# Altium project carrier.PrjPcb (part 2 of 2)

## Sheet ethernet_hdmi.SchDoc: Ethernet & HDMI
size A4; Organization: GPA Robotics; DocumentNumber: 9; Revision: REV 0; SheetNumber: 9; SheetTotal: 11
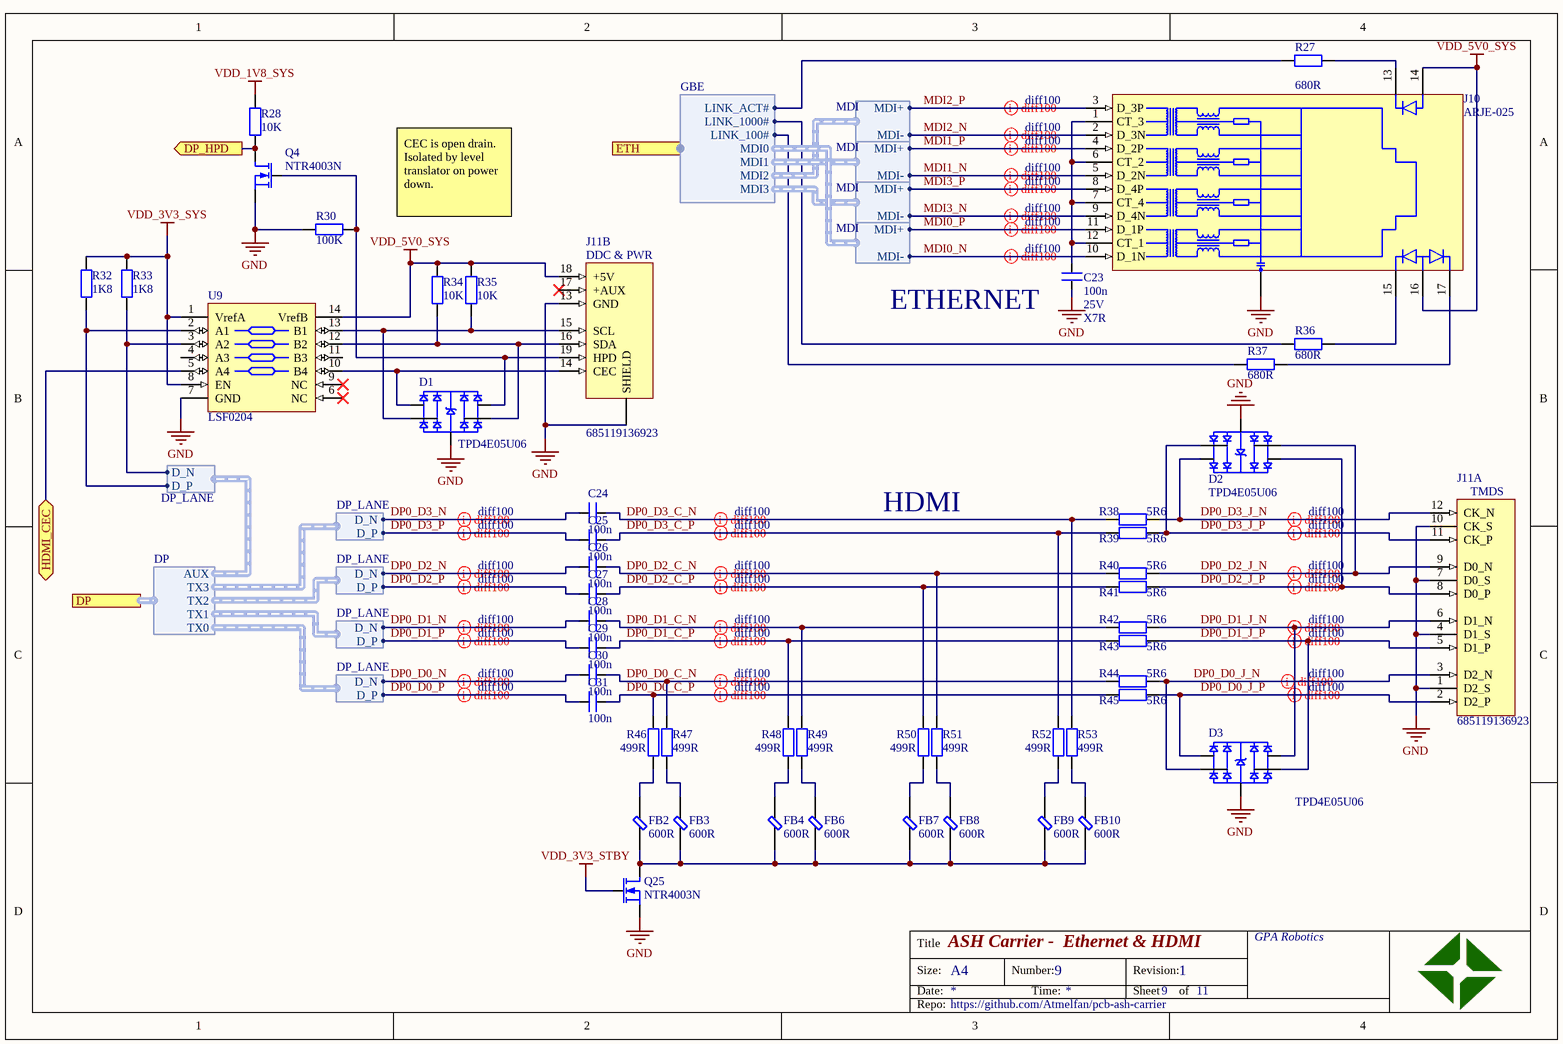
[diagram p7: ethernet_hdmi.SchDoc]

### Parts
C23  value 100n  Voltage: 25V  Type: X7R  [C1005[0402]]  (hidden comment: cap)
C24  value 100n  [C1005[0402]]  (hidden comment: cap)
C25  value 100n  [C1005[0402]]  (hidden comment: cap)
C26  value 100n  [C1005[0402]]  (hidden comment: cap)
C27  value 100n  [C1005[0402]]  (hidden comment: cap)
C28  value 100n  [C1005[0402]]  (hidden comment: cap)
C29  value 100n  [C1005[0402]]  (hidden comment: cap)
C30  value 100n  [C1005[0402]]  (hidden comment: cap)
C31  value 100n  [C1005[0402]]  (hidden comment: cap)
D1  TPD4E05U06  [TI_PSON50P100X55-10N]
D2  TPD4E05U06  [TI_PSON50P100X55-10N]
D3  TPD4E05U06  [TI_PSON50P100X55-10N]
FB2  value 600R  [FBC1005X06N]  (hidden comment: Ferrite bead)
FB3  value 600R  [FBC1005X06N]  (hidden comment: Ferrite bead)
FB4  value 600R  [FBC1005X06N]  (hidden comment: Ferrite bead)
FB6  value 600R  [FBC1005X06N]  (hidden comment: Ferrite bead)
FB7  value 600R  [FBC1005X06N]  (hidden comment: Ferrite bead)
FB8  value 600R  [FBC1005X06N]  (hidden comment: Ferrite bead)
FB9  value 600R  [FBC1005X06N]  (hidden comment: Ferrite bead)
FB10  value 600R  [FBC1005X06N]  (hidden comment: Ferrite bead)
J10  ARJE-025  [abraconn_rj45_arje0025]
J11  685119136923  [wurth_hdmi_mini]  (parts A,B of 2)
Q4  NTR4003N  [NCH_SOT95P237X110-3N]
Q25  NTR4003N  [NCH_SOT95P237X110-3N]
R27  value 680R  [R1005[0402]]  (hidden comment: res)
R28  value 10K  [R1005[0402]]  (hidden comment: res)
R30  value 100K  [R1005[0402]]  (hidden comment: res)
R32  value 1K8  [R1005[0402]]  (hidden comment: res)
R33  value 1K8  [R1005[0402]]  (hidden comment: res)
R34  value 10K  [R1005[0402]]  (hidden comment: res)
R35  value 10K  [R1005[0402]]  (hidden comment: res)
R36  value 680R  [R1005[0402]]  (hidden comment: res)
R37  value 680R  [R1005[0402]]  (hidden comment: res)
R38  value 5R6  [R1005[0402]]  (hidden comment: res)
R39  value 5R6  [R1005[0402]]  (hidden comment: res)
R40  value 5R6  [R1005[0402]]  (hidden comment: res)
R41  value 5R6  [R1005[0402]]  (hidden comment: res)
R42  value 5R6  [R1005[0402]]  (hidden comment: res)
R43  value 5R6  [R1005[0402]]  (hidden comment: res)
R44  value 5R6  [R1005[0402]]  (hidden comment: res)
R45  value 5R6  [R1005[0402]]  (hidden comment: res)
R46  value 499R  [R1005[0402]]  (hidden comment: res)
R47  value 499R  [R1005[0402]]  (hidden comment: res)
R48  value 499R  [R1005[0402]]  (hidden comment: res)
R49  value 499R  [R1005[0402]]  (hidden comment: res)
R50  value 499R  [R1005[0402]]  (hidden comment: res)
R51  value 499R  [R1005[0402]]  (hidden comment: res)
R52  value 499R  [R1005[0402]]  (hidden comment: res)
R53  value 499R  [R1005[0402]]  (hidden comment: res)
U9  LSF0204  [TI_TSOP65P640X120-14N]

### Ports
DP (harness DP), DP_HPD (out), ETH (harness GBE), HDMI_CEC (bidir)

### Harnesses
GBE: LINK_ACT#, LINK_1000#, LINK_100#, MDI0, MDI1, MDI2, MDI3
MDI: MDI+, MDI-
DP_LANE: D_N, D_P
DP: TX0, TX1, TX2, TX3, AUX

### Nets
GND: C23.1 D1.3(GND) D2.3(GND) D3.3(GND) J10.SHIELD J11.1(D2_S) J11.4(D1_S) J11.7(D0_S) J11.10(CK_S) J11.13(GND) J11.SHIELD Q4.S Q25.S R30.2 U9.7(GND)
VDD_1V8_SYS: R28.2
VDD_3V3_STBY: Q25.G
VDD_3V3_SYS: R32.2 R33.2 U9.1(VrefA) U9.8(EN)
VDD_5V0_SYS: J10.14 J10.16 J11.18(+5V) R34.2 R35.2 U9.14(VrefB)
DP0_D0_C_N: C30.1 R44.1 R47.2
DP0_D0_C_P: C31.1 R45.1 R46.2
DP0_D0_J_N: D3.4(D2-) J11.3(D2_N) R44.2
DP0_D0_J_P: D3.5(D2+) J11.2(D2_P) R45.2
DP0_D0_N: C30.2 ; harness DP_LANE.D_N
DP0_D0_P: C31.2 ; harness DP_LANE.D_P
DP0_D1_C_N: C28.1 R42.1 R49.2
DP0_D1_C_P: C29.1 R43.1 R48.2
DP0_D1_J_N: D3.1(D1+) J11.6(D1_N) R42.2
DP0_D1_J_P: D3.2(D1-) J11.5(D1_P) R43.2
DP0_D1_N: C28.2 ; harness DP_LANE.D_N
DP0_D1_P: C29.2 ; harness DP_LANE.D_P
DP0_D2_C_N: C26.1 R40.1 R51.2
DP0_D2_C_P: C27.1 R41.1 R50.2
DP0_D2_J_N: D2.2(D1-) J11.9(D0_N) R40.2
DP0_D2_J_P: D2.1(D1+) J11.8(D0_P) R41.2
DP0_D2_N: C26.2 ; harness DP_LANE.D_N
DP0_D2_P: C27.2 ; harness DP_LANE.D_P
DP0_D3_C_N: C24.1 R38.1 R53.2
DP0_D3_C_P: C25.1 R39.1 R52.2
DP0_D3_J_N: D2.5(D2+) J11.12(CK_N) R38.2
DP0_D3_J_P: D2.4(D2-) J11.11(CK_P) R39.2
DP0_D3_N: C24.2 ; harness DP_LANE.D_N
DP0_D3_P: C25.2 ; harness DP_LANE.D_P
MDI0_N: J10.10(D_1N) ; harness MDI.MDI-
MDI0_P: J10.11(D_1P) ; harness MDI.MDI+
MDI1_N: J10.5(D_2N) ; harness MDI.MDI-
MDI1_P: J10.4(D_2P) ; harness MDI.MDI+
MDI2_N: J10.2(D_3N) ; harness MDI.MDI-
MDI2_P: J10.3(D_3P) ; harness MDI.MDI+
MDI3_N: J10.9(D_4N) ; harness MDI.MDI-
MDI3_P: J10.8(D_4P) ; harness MDI.MDI+
NetC23_2: C23.2 J10.1(CT_3) J10.6(CT_2) J10.7(CT_4) J10.12(CT_1)
NetD1_1: D1.1(D1+) J11.14(CEC) U9.10(B4)
NetD1_2: D1.2(D1-) J11.15(SCL) R35.1 U9.13(B1)
NetD1_4: D1.4(D2-) J11.16(SDA) R34.1 U9.12(B2)
NetD1_5: D1.5(D2+) J11.19(HPD) Q4.G R30.1
NetFB2_1: FB2.1 FB3.1 FB4.1 FB6.1 FB7.1 FB8.1 FB9.1 FB10.1 Q25.D
NetFB2_2: FB2.2 R46.1
NetFB3_2: FB3.2 R47.1
NetFB4_2: FB4.2 R48.1
NetFB6_2: FB6.2 R49.1
NetFB7_2: FB7.2 R50.1
NetFB8_2: FB8.2 R51.1
NetFB9_2: FB9.2 R52.1
NetFB10_2: FB10.2 R53.1
NetJ1_B33: U9.5(A4) ; port HDMI_CEC
NetJ1_B34: R33.1 U9.3(A2) ; harness DP_LANE.D_N
NetJ1_B35: R32.1 U9.2(A1) ; harness DP_LANE.D_P
NetJ1_B36: Q4.D R28.1 ; port DP_HPD
NetJ1_E47: R27.2 ; port ETH.LINK_ACT#
NetJ1_F46: R36.1 ; port ETH.LINK_1000#
NetJ1_F50: R37.2 ; port ETH.LINK_100#
NetJ10_13: J10.13 R27.1
NetJ10_15: J10.15 R36.2
NetJ10_17: J10.17 R37.1

Not connected (* = marked no-connect by the designer): J11 17(+AUX)*; U9 4(A3) 6(NC)* 9(NC)* 11(B3)

### Layout directives
differential pair; net class diff100: DP0_D0_C_N, DP0_D0_C_P, DP0_D0_J_N, DP0_D0_J_P, DP0_D0_N, DP0_D0_P, DP0_D1_C_N, DP0_D1_C_P, DP0_D1_J_N, DP0_D1_J_P, DP0_D1_N, DP0_D1_P, DP0_D2_C_N, DP0_D2_C_P, DP0_D2_J_N, DP0_D2_J_P, DP0_D2_N, DP0_D2_P, DP0_D3_C_N, DP0_D3_C_P, DP0_D3_J_N, DP0_D3_J_P, DP0_D3_N, DP0_D3_P, MDI0_N, MDI0_P, MDI1_N, MDI1_P, MDI2_N, MDI2_P, MDI3_N, MDI3_P

### Notes on the sheet
- CEC is open drain.
  Isolated by level translator on power down.
- ETHERNET
- HDMI
- Title
- Size:
- Date:
- A4
- Number:
- Time:
- Revision:
- Sheet
- of
- Repo:
- (in symbol hdmi_mini_c, part A) TMDS
- (in symbol hdmi_mini_c, part B) DDC & PWR

### Library data of the parts
C23 = cap: Capacitor; Manufacturer: *; Series: *
C24-C31 = cap: Capacitor; Voltage: 25V; Type: X7R; Manufacturer: *; Series: *
FB2-FB4 FB6-FB10 = ferrite_bead: Frequency: 100M
J10 = geth_wmagnetics: RJ45 with integrated magnetics
J11 = hdmi_mini_c
Q4 Q25 = nch_mosfet
R27 R28 R30 R32-R53 = res: Resistor

## Sheet m2_connector.SchDoc: SD card & expansion
size A4; Organization: GPA Robotics; DocumentNumber: 4; Revision: REV 0; SheetNumber: 4; SheetTotal: 11
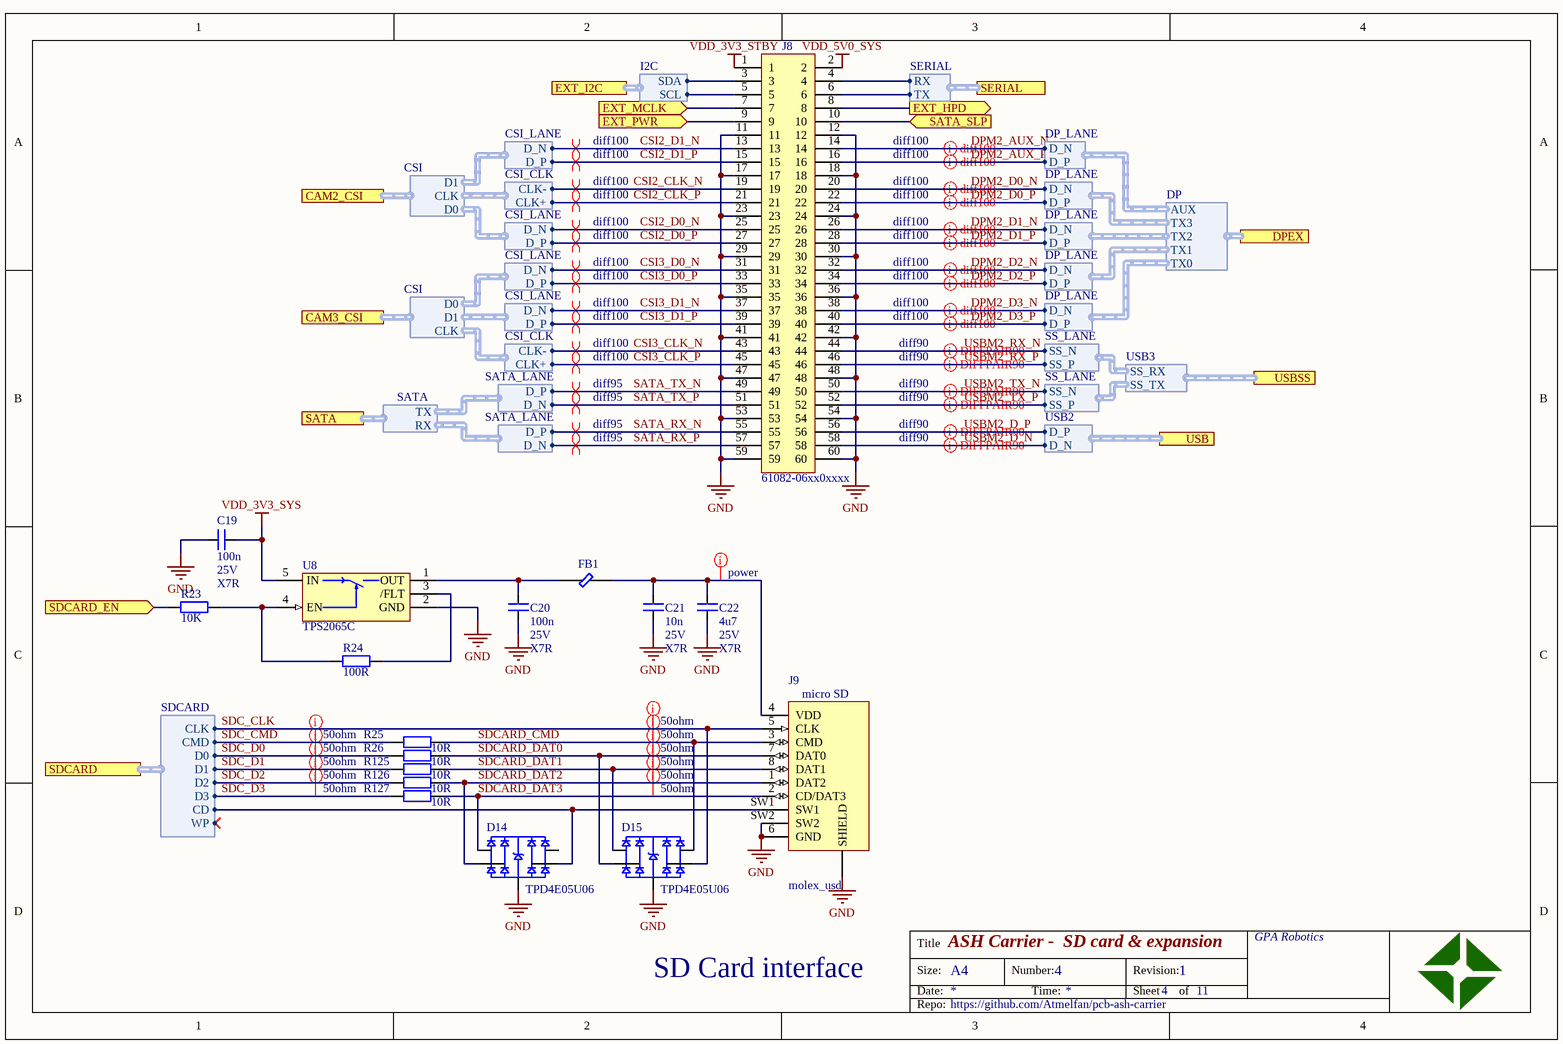
[diagram p8: m2_connector.SchDoc]

### Parts
C19  value 100n  Voltage: 25V  Type: X7R  [C1005[0402]]  (hidden comment: cap)
C20  value 100n  Voltage: 25V  Type: X7R  [C1005[0402]]  (hidden comment: cap)
C21  value 10n  Voltage: 25V  Type: X7R  [C1005[0402]]  (hidden comment: cap)
C22  value 4u7  Voltage: 25V  Type: X7R  [C3216[1206]]  (hidden comment: cap)
D14  TPD4E05U06  [TI_PSON50P100X55-10N]
D15  TPD4E05U06  [TI_PSON50P100X55-10N]
FB1  2506036007Y3  [FBC1608X07N]  (value not drawn)
J8  61082-06xx0xxxx  [fci_mezzanine_61082]
J9  molex_usd  [molex_usd]
R23  value 10K  [R1005[0402]]  (hidden comment: res)
R24  value 100R  [R1005[0402]]  (hidden comment: res)
R25  value 10R  [R1005[0402]]  (hidden comment: res)
R26  value 10R  [R1005[0402]]  (hidden comment: res)
R125  value 10R  [R1005[0402]]  (hidden comment: res)
R126  value 10R  [R1005[0402]]  (hidden comment: res)
R127  value 10R  [R1005[0402]]  (hidden comment: res)
U8  TPS2065C  [TI_SOT95P280X145-5N]

### Ports
CAM2_CSI (harness CSI), CAM3_CSI (harness CSI), DPEX (harness DP), EXT_HPD (out), EXT_I2C (harness I2C), EXT_MCLK (in), EXT_PWR (in), SATA (harness SATA), SATA_SLP (in), SDCARD (harness SDCARD), SDCARD_EN (in), SERIAL (harness SERIAL), USB (harness USB2), USBSS (harness USB3)

### Harnesses
SDCARD: CLK, CMD, WP, CD, D0, D1, D2, D3
SS_LANE: SS_P, SS_N
USB3: SS_RX, SS_TX
DP_LANE: D_N, D_P
DP: TX0, TX1, TX2, TX3, AUX
CSI_LANE: D_P, D_N
CSI_CLK: CLK-, CLK+
CSI: CLK, D0, D1
I2C: SDA, SCL
SATA_LANE: D_P, D_N
SATA: TX, RX
SERIAL: RX, TX
USB2: D_P, D_N

### Nets
GND: C19.2 C20.1 C21.1 C22.1 D14.3(GND) D15.3(GND) J8.11 J8.12 J8.17 J8.18 J8.23 J8.24 J8.29 J8.30 J8.35 J8.36 J8.41 J8.42 J8.47 J8.48 J8.53 J8.54 J8.59 J8.60 J9.6(GND) J9.SHIELD J9.SW2 U8.2(GND)
VDD_3V3_STBY: J8.1
VDD_3V3_SYS: C19.1 U8.5(IN)
VDD_5V0_SYS: J8.2
CSI2_CLK_N: J8.19 ; harness CSI_CLK.CLK-
CSI2_CLK_P: J8.21 ; harness CSI_CLK.CLK+
CSI2_D0_N: J8.25 ; harness CSI_LANE.D_N
CSI2_D0_P: J8.27 ; harness CSI_LANE.D_P
CSI2_D1_N: J8.13 ; harness CSI_LANE.D_N
CSI2_D1_P: J8.15 ; harness CSI_LANE.D_P
CSI3_CLK_N: J8.43 ; harness CSI_CLK.CLK-
CSI3_CLK_P: J8.45 ; harness CSI_CLK.CLK+
CSI3_D0_N: J8.31 ; harness CSI_LANE.D_N
CSI3_D0_P: J8.33 ; harness CSI_LANE.D_P
CSI3_D1_N: J8.37 ; harness CSI_LANE.D_N
CSI3_D1_P: J8.39 ; harness CSI_LANE.D_P
DPM2_AUX_N: J8.14 ; harness DP_LANE.D_N
DPM2_AUX_P: J8.16 ; harness DP_LANE.D_P
DPM2_D0_N: J8.20 ; harness DP_LANE.D_N
DPM2_D0_P: J8.22 ; harness DP_LANE.D_P
DPM2_D1_N: J8.26 ; harness DP_LANE.D_N
DPM2_D1_P: J8.28 ; harness DP_LANE.D_P
DPM2_D2_N: J8.32 ; harness DP_LANE.D_N
DPM2_D2_P: J8.34 ; harness DP_LANE.D_P
DPM2_D3_N: J8.38 ; harness DP_LANE.D_N
DPM2_D3_P: J8.40 ; harness DP_LANE.D_P
SATA_RX_N: J8.55 ; harness SATA_LANE.D_P
SATA_RX_P: J8.57 ; harness SATA_LANE.D_N
SATA_TX_N: J8.49 ; harness SATA_LANE.D_P
SATA_TX_P: J8.51 ; harness SATA_LANE.D_N
SDC_CLK: D15.4(D2-) J9.5(CLK) ; port SDCARD.CLK
SDC_CMD: R25.1 ; port SDCARD.CMD
SDC_D0: R26.1 ; port SDCARD.D0
SDC_D1: R125.1 ; port SDCARD.D1
SDC_D2: R126.1 ; port SDCARD.D2
SDC_D3: R127.1 ; port SDCARD.D3
SDCARD_CMD: D15.5(D2+) J9.3(CMD) R25.2
SDCARD_DAT0: D15.2(D1-) J9.7(DAT0) R26.2
SDCARD_DAT1: D15.1(D1+) J9.8(DAT1) R125.2
SDCARD_DAT2: D14.2(D1-) J9.1(DAT2) R126.2
SDCARD_DAT3: D14.1(D1+) J9.2(CD/DAT3) R127.2
USBM2_D_N: J8.58 ; port USB.D_N
USBM2_D_P: J8.56 ; port USB.D_P
USBM2_RX_N: J8.44 ; harness SS_LANE.SS_N
USBM2_RX_P: J8.46 ; harness SS_LANE.SS_P
USBM2_TX_N: J8.50 ; harness SS_LANE.SS_N
USBM2_TX_P: J8.52 ; harness SS_LANE.SS_P
NetC20_2: C20.2 FB1.1 U8.1(OUT)
NetC21_2: C21.2 C22.2 FB1.2 J9.4(VDD)
NetD14_4: D14.4(D2-) J9.SW1 ; port SDCARD.CD
NetJ1_A20: J8.3 ; port EXT_I2C.SDA
NetJ1_A21: J8.5 ; port EXT_I2C.SCL
NetJ1_A33: J8.8 ; port EXT_HPD
NetJ1_B15: J8.4 ; port SERIAL.RX
NetJ1_B16: J8.6 ; port SERIAL.TX
NetJ1_D47: J8.10 ; port SATA_SLP
NetJ1_F7: J8.9 ; port EXT_PWR
NetJ1_F8: J8.7 ; port EXT_MCLK
NetJ1_H16: R23.1 ; port SDCARD_EN
NetR23_2: R23.2 R24.1 U8.4(EN)
NetR24_2: R24.2 U8.3(/FLT)

Not connected (* = marked no-connect by the designer): D14 5(D2+)

### Layout directives
net class power: NetC21_2
differential pair; net class diff90: USBM2_D_N, USBM2_D_P, USBM2_RX_N, USBM2_RX_P, USBM2_TX_N, USBM2_TX_P
differential pair; net class diff100: CSI2_CLK_N, CSI2_CLK_P, CSI2_D0_N, CSI2_D0_P, CSI2_D1_N, CSI2_D1_P, CSI3_CLK_N, CSI3_CLK_P, CSI3_D0_N, CSI3_D0_P, CSI3_D1_N, CSI3_D1_P, DPM2_AUX_N, DPM2_AUX_P, DPM2_D0_N, DPM2_D0_P, DPM2_D1_N, DPM2_D1_P, DPM2_D2_N, DPM2_D2_P, DPM2_D3_N, DPM2_D3_P
differential pair; net class diff95: SATA_RX_N, SATA_RX_P, SATA_TX_N, SATA_TX_P
net class 50ohm: SDC_CLK, SDC_CMD, SDC_D0, SDC_D1, SDC_D2, SDC_D3, SDCARD_CMD, SDCARD_DAT0, SDCARD_DAT1, SDCARD_DAT2, SDCARD_DAT3

### Notes on the sheet
- SD Card interface
- Title
- Size:
- Date:
- A4
- Number:
- Time:
- Revision:
- Sheet
- of
- Repo:
- (in symbol molex_usd) micro SD

### Library data of the parts
C19-C22 = cap: Capacitor; Manufacturer: *; Series: *
FB1 = ferrite_bead: Ferrite bead
J8 = mezzanine_2x30
R23-R26 R125-R127 = res: Resistor

## Sheet sound.SchDoc: Sound
size A4; DocumentNumber: 10; SheetNumber: 10; SheetTotal: 11
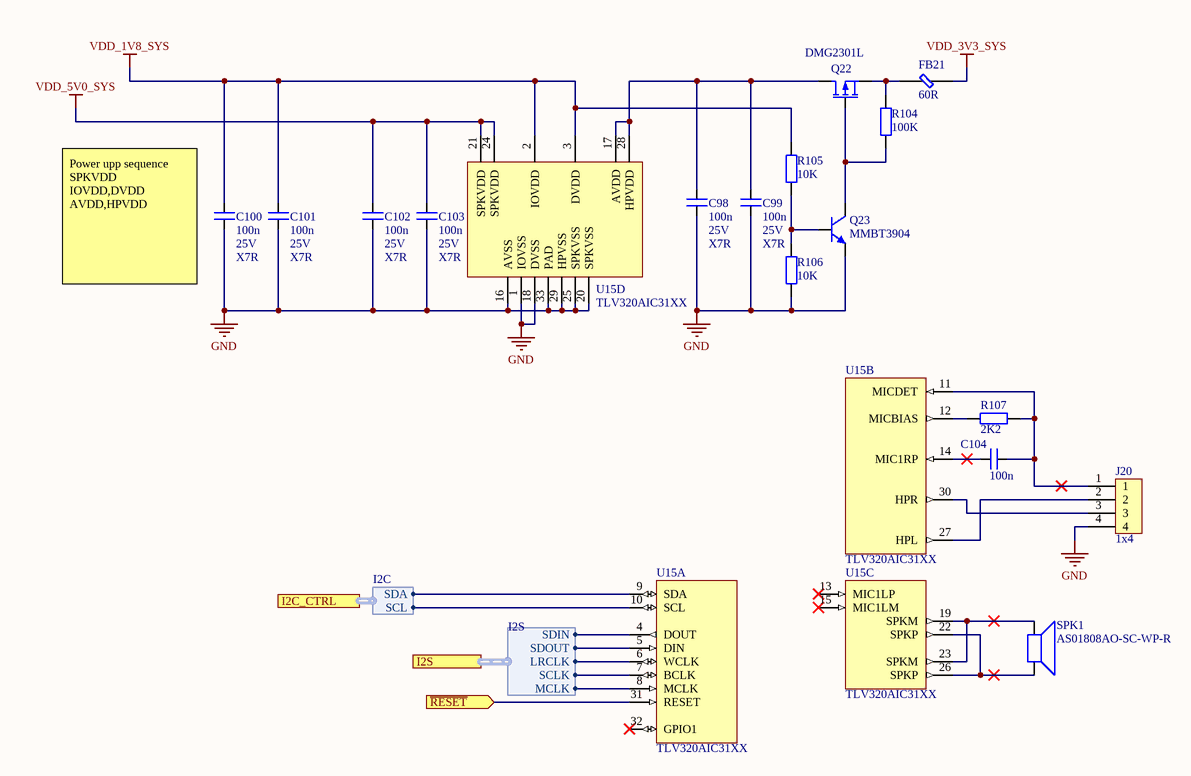
[diagram p9: sound.SchDoc]

### Parts
C98  value 100n  Voltage: 25V  Type: X7R  [C1005[0402]]  (hidden comment: cap)
C99  value 100n  Voltage: 25V  Type: X7R  [C1005[0402]]  (hidden comment: cap)
C100  value 100n  Voltage: 25V  Type: X7R  [C1005[0402]]  (hidden comment: cap)
C101  value 100n  Voltage: 25V  Type: X7R  [C1005[0402]]  (hidden comment: cap)
C102  value 100n  Voltage: 25V  Type: X7R  [C1005[0402]]  (hidden comment: cap)
C103  value 100n  Voltage: 25V  Type: X7R  [C1005[0402]]  (hidden comment: cap)
C104  value 100n  [C1005[0402]]  (hidden comment: cap)
FB21  value 60R  [FBC1608X07N]  (hidden comment: Ferrite bead)
J20  1x4  [molex_picoblade_1x4]
Q22  DMG2301L  [NCH_SOT95P237X110-3N]
Q23  MMBT3904  [NPN_SOT95P230X110-3N]
R104  value 100K  [R1005[0402]]  (hidden comment: res)
R105  value 10K  [R1005[0402]]  (hidden comment: res)
R106  value 10K  [R1005[0402]]  (hidden comment: res)
R107  value 2K2  [R1005[0402]]  (hidden comment: res)
SPK1  AS01808AO-SC-WP-R  [pui_audio_speaker]
U15  TLV320AIC31XX  [TI_QFN50P500X500X100_HS-33M]  (parts A,B,C,D of 4)

### Ports
I2C_CTRL (harness I2C), I2S (harness I2S), ~{RESET} (in)

### Harnesses
I2S: MCLK, LRCLK, SCLK, SDOUT, SDIN
I2C: SCL, SDA

### Nets
GND: C98.1 C99.1 C100.1 C101.1 C102.1 C103.1 J20.4 Q23.E R106.1 U15.1(IOVSS) U15.16(AVSS) U15.18(DVSS) U15.20(SPKVSS) U15.25(SPKVSS) U15.29(HPVSS) U15.33(PAD)
VDD_1V8_SYS: C100.2 C101.2 R105.1 U15.2(IOVDD) U15.3(DVDD)
VDD_3V3_SYS: FB21.1
VDD_5V0_SYS: C102.2 C103.2 U15.21(SPKVDD) U15.24(SPKVDD)
NetC98_2: C98.2 C99.2 Q22.D U15.17(AVDD) U15.28(HPVDD)
NetC104_1: C104.1 U15.14(MIC1RP)
NetC104_2: C104.2 J20.1 R107.1 U15.11(MICDET)
NetFB21_2: FB21.2 Q22.S R104.2
NetJ1_D15: U15.9(SDA) ; port I2C_CTRL.SDA
NetJ1_E15: U15.10(SCL) ; port I2C_CTRL.SCL
NetJ1_F1: U15.8(MCLK) ; port I2S.MCLK
NetJ1_F2: U15.31(RESET) ; port ~{RESET}
NetJ1_G1: U15.4(DOUT) ; port I2S.SDIN
NetJ1_G2: U15.7(BCLK) ; port I2S.SCLK
NetJ1_H1: U15.6(WCLK) ; port I2S.LRCLK
NetJ1_H2: U15.5(DIN) ; port I2S.SDOUT
NetJ20_2: J20.2 U15.27(HPL)
NetJ20_3: J20.3 U15.30(HPR)
NetQ22_G: Q22.G Q23.C R104.1
NetQ23_B: Q23.B R105.2 R106.2
NetR107_2: R107.2 U15.12(MICBIAS)
NetSPK1_1: SPK1.1 U15.19(SPKM) U15.23(SPKM)
NetSPK1_2: SPK1.2 U15.22(SPKP) U15.26(SPKP)

Not connected (* = marked no-connect by the designer): U15 13(MIC1LP)* 15(MIC1LM)* 32(GPIO1)*

### Notes on the sheet
- (near C100) Power upp sequence
  SPKVDD
  IOVDD,DVDD
  AVDD,HPVDD
- Title
- Size:
- Date:
- A4
- Number:
- Time:
- Revision:
- Sheet
- of
- Repo:

### Library data of the parts
C98-C103 = cap: Capacitor; Manufacturer: *; Series: *
C104 = cap: Capacitor; Voltage: 25V; Type: X7R; Manufacturer: *; Series: *
FB21 = ferrite_bead: Frequency: 100M
J20 = header_1x4
Q22 = pch_mosfet
Q23 = npn_bipolar: NPN Bipolar Transistor; Published: 8-Jun-2000; LatestRevisionDate: 17-Jul-2002; LatestRevisionNote: Re-released for DXP Platform.; PackageReference: TO-226-AA; Publisher: Altium Limited; PackageDescription: TO, Flat Index; 3 In-Line, Axial Leads; Body Dia. 4.8mm; Leads 0.55 x 0.51 mm (max); Code_JEDEC: TO-226-AA
R104-R107 = res: Resistor
SPK1 = speaker
U15 = tlv320aic3100

## Sheet front_io.SchDoc: LED driver & Gyro
size A4; Organization: GPA Robotics; DocumentNumber: 11; Revision: REV 0; SheetNumber: 11; SheetTotal: 11
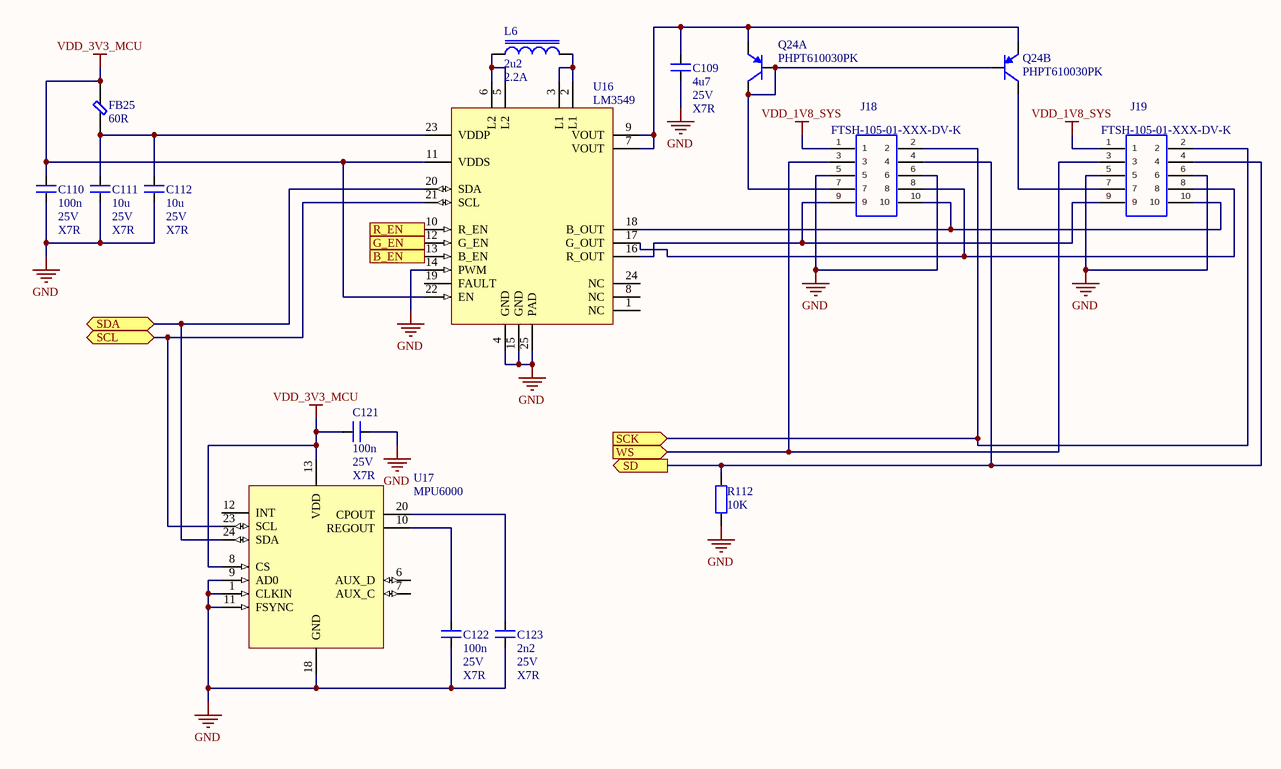
[diagram p10: front_io.SchDoc]

### Parts
C109  value 4u7  Voltage: 25V  Type: X7R  [C3216[1206]]  (hidden comment: cap)
C110  value 100n  Voltage: 25V  Type: X7R  [C1005[0402]]  (hidden comment: cap)
C111  value 10u  Voltage: 25V  Type: X7R  [C3216[1206]]  (hidden comment: cap)
C112  value 10u  Voltage: 25V  Type: X7R  [C3216[1206]]  (hidden comment: cap)
C121  value 100n  Voltage: 25V  Type: X7R  [C1005[0402]]  (hidden comment: cap)
C122  value 100n  Voltage: 25V  Type: X7R  [C1005[0402]]  (hidden comment: cap)
C123  value 2n2  Voltage: 25V  Type: X7R  [C1005[0402]]  (hidden comment: cap)
FB25  value 60R  [FBC1608X07N]  (hidden comment: Ferrite bead)
J18  FTSH-105-01-XXX-DV-K  [FTSH-105-01-XXX-DV-K]
J19  FTSH-105-01-XXX-DV-K  [FTSH-105-01-XXX-DV-K]
L6  value 2u2  Current: 2.2A  [YUDEN_NRS4018T-XXXMDGJ]  (hidden comment: ASPI-0630LR-XXXM-T15)
Q24  PHPT610030PK  [NXP_LFPAK56D127P610X105-8N]  (parts A,B of 2)
R112  value 10K  [R1005[0402]]  (hidden comment: res)
U16  LM3549  [TI_QFN50P400X400X80_HS-25M]
U17  MPU6000  [INVSENSE_QFN50P400X400X95_HS-25M]

### Ports
B_EN (in), G_EN (in), R_EN (in), SCK (in), SCL (bidir), SD (out), SDA (bidir), WS (in)

### Nets
GND: C109.1 C110.1 C111.1 C112.1 C121.2 C122.2 C123.2 J18.5 J18.6 J19.5 J19.6 R112.1 U16.4(GND) U16.14(PWM) U16.15(GND) U16.25(PAD) U17.1(CLKIN) U17.9(AD0) U17.11(FSYNC) U17.18(GND)
VDD_1V8_SYS: J18.1 J19.1
VDD_3V3_MCU: C110.2 C121.1 FB25.2 U16.11(VDDS) U16.22(EN) U17.8(CS) U17.13(VDD)
MCU_SCL: U16.21(SCL) U17.23(SCL) ; port SCL
MCU_SDA: U16.20(SDA) U17.24(SDA) ; port SDA
NVM_SCK: J18.2 J19.2 ; port SCK
NVM_SD: J18.4 J19.4 R112.2 ; port SD
NVM_WS: J18.3 J19.3 ; port WS
NetC109_2: C109.2 Q24.E1 Q24.E2 U16.7(VOUT) U16.9(VOUT)
NetC111_2: C111.2 C112.2 FB25.1 U16.23(VDDP)
NetC122_1: C122.1 U17.10(REGOUT)
NetC123_1: C123.1 U17.20(CPOUT)
NetJ18_7: J18.7 Q24.B1 Q24.B2 Q24.C1
NetJ18_8: J18.8 J19.8 U16.17(G_OUT)
NetJ18_9: J18.9 J19.9 U16.16(R_OUT)
NetJ18_10: J18.10 J19.10 U16.18(B_OUT)
NetJ19_7: J19.7 Q24.C2
NetL6_1: L6.1 U16.5(L2) U16.6(L2)
NetL6_2: L6.2 U16.2(L1) U16.3(L1)
NetU1_59: U16.10(R_EN) ; port R_EN
NetU1_61: U16.12(G_EN) ; port G_EN
NetU1_62: U16.13(B_EN) ; port B_EN

Not connected (* = marked no-connect by the designer): U16 1(NC) 8(NC) 19(FAULT) 24(NC); U17 6(AUX_D) 7(AUX_C) 12(INT)

### Notes on the sheet
- Title
- Size:
- Date:
- A4
- Number:
- Time:
- Revision:
- Sheet
- of
- Repo:

### Library data of the parts
C109-C112 C121-C123 = cap: Capacitor; Manufacturer: *; Series: *
FB25 = ferrite_bead: Frequency: 100M
J18 J19 = FTSH-105-01-XXX-DV-K: TERMINAL STRIP, .050"(1.27mm) PITCH, 10 PINS, KEYED; MANUFACTURER: SAMTEC; CREATED: November 30, 2016 - Wendy Xin; PCB DECAL: FTSH-105-01-XXX-DV-K
L6 = ind
Q24 = pnp_bipolar_dual: PNP Bipolar Transistor; Published: 8-Jun-2000; LatestRevisionDate: 29-May-2009; LatestRevisionNote: IPC-7351 Footprint Added.; PackageVersion: Aug-1999; PackageReference: SOT-23B; Publisher: Altium Limited; PackageDescription: 3-Pin SOT-23 Package 0.95 mm Pitch, 2.4 mm Lead Span
R112 = res: Resistor; Tolerance: 5%
U17 = invsense_mpu6000

## Sheet coverpage.SchDoc: Cover
size A4; Organization: GPA Robotics; DocumentNumber: 1; SheetNumber: 1; SheetTotal: 11
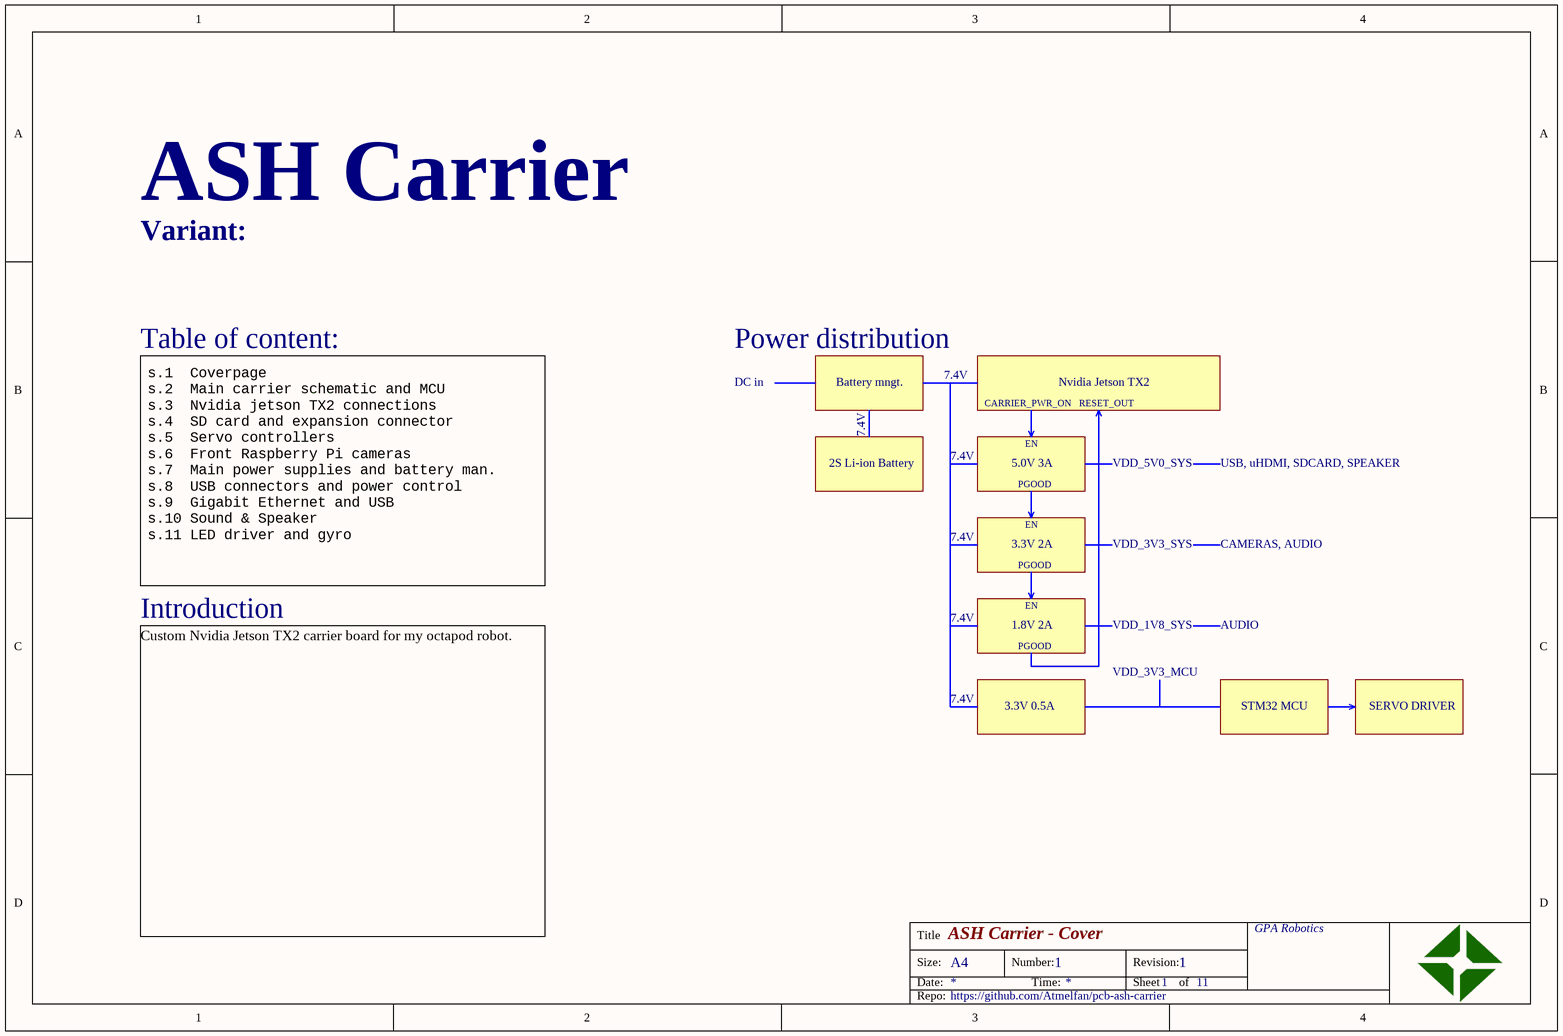
[diagram p11: coverpage.SchDoc]

### Notes on the sheet
- Table of content:
- DC in
- Power distribution
- Battery mngt.
- 7.4V
- Nvidia Jetson TX2
- CARRIER_PWR_ON
- EN
- RESET_OUT
- 2S Li-ion Battery
- 5.0V 3A
- PGOOD
- VDD_5V0_SYS
- USB, uHDMI, SDCARD, SPEAKER
- s.1  Coverpage
  s.2  Main carrier schematic and MCU
  s.3  Nvidia jetson TX2 connections
  s.4  SD card and expansion connector
  s.5  Servo controllers
  s.6  Front Raspberry Pi cameras
  s.7  Main power supplies and battery man.
  s.8  USB connectors and power control
  s.9  Gigabit Ethernet and USB
  s.10 Sound & Speaker
  s.11 LED driver and gyro
- 3.3V 2A
- VDD_3V3_SYS
- CAMERAS, AUDIO
- Introduction
- 1.8V 2A
- VDD_1V8_SYS
- AUDIO
- 3.3V 0.5A
- VDD_3V3_MCU
- STM32 MCU
- SERVO DRIVER
- Custom Nvidia Jetson TX2 carrier board for my octapod robot.
- Variant:
- Title
- Size:
- Date:
- A4
- Number:
- Time:
- Revision:
- Sheet
- of
- Repo:

## Nets that join several sheets
GND: carrier (53 pins), module (86 pins), SR1 (11 pins), SR2 (10 pins), front_raspicams (19 pins), psu_and_discharge (94 pins), usb_connectors (20 pins), ethernet_hdmi (15 pins), m2_connector (28 pins), sound (16 pins), front_io (20 pins)
VDD_1V8_SYS: carrier (6 pins), front_raspicams (7 pins), psu_and_discharge (5 pins), ethernet_hdmi (R28.2), sound (5 pins), front_io (J18.1 J19.1)
VDD_3V3_MCU: carrier (16 pins), SR1 (6 pins), SR2 (7 pins), psu_and_discharge (7 pins), front_io (7 pins)
VDD_3V3_STBY: psu_and_discharge (6 pins), ethernet_hdmi (Q25.G), m2_connector (J8.1)
VDD_3V3_SYS: carrier (5 pins), front_raspicams (15 pins), psu_and_discharge (7 pins), ethernet_hdmi (R32.2 R33.2 U9.1 U9.8), m2_connector (C19.1 U8.5), sound (FB21.1)
VDD_5V0_SYS: carrier (J16.2 R29.1), psu_and_discharge (5 pins), usb_connectors (C86.1 C92.1 U13.5 U14.5), ethernet_hdmi (6 pins), m2_connector (J8.2), sound (C102.2 C103.2 U15.21 U15.24)
VDD_RTC: carrier (C39.1), module (J1.A50)
VIN_NVM: module (6 pins), psu_and_discharge (7 pins)
CHRG_OK: carrier (U1.43), psu_and_discharge (U12.4)
CPWR: carrier (R8.1), module (J1.A48)
CRST: carrier (R5.1), module (J1.A46)
CSI0_CLK_N: module (J1.G21), front_raspicams (J5.8)
CSI0_CLK_P: module (J1.G22), front_raspicams (J5.9)
CSI0_D0_N: module (J1.F22), front_raspicams (J5.2)
CSI0_D0_P: module (J1.F23), front_raspicams (J5.3)
CSI0_D1_N: module (J1.H20), front_raspicams (J5.5)
CSI0_D1_P: module (J1.H21), front_raspicams (J5.6)
CSI1_CLK_N: module (J1.G27), front_raspicams (J4.8)
CSI1_CLK_P: module (J1.G28), front_raspicams (J4.9)
CSI1_D0_N: module (J1.F28), front_raspicams (J4.2)
CSI1_D0_P: module (J1.F29), front_raspicams (J4.3)
CSI1_D1_N: module (J1.H26), front_raspicams (J4.5)
CSI1_D1_P: module (J1.H27), front_raspicams (J4.6)
CSI2_CLK_N: module (J1.D21), m2_connector (J8.19)
CSI2_CLK_P: module (J1.D22), m2_connector (J8.21)
CSI2_D0_N: module (J1.C22), m2_connector (J8.25)
CSI2_D0_P: module (J1.C23), m2_connector (J8.27)
CSI2_D1_N: module (J1.E20), m2_connector (J8.13)
CSI2_D1_P: module (J1.E21), m2_connector (J8.15)
CSI3_CLK_N: module (J1.D27), m2_connector (J8.43)
CSI3_CLK_P: module (J1.D28), m2_connector (J8.45)
CSI3_D0_N: module (J1.C28), m2_connector (J8.31)
CSI3_D0_P: module (J1.C29), m2_connector (J8.33)
CSI3_D1_N: module (J1.E26), m2_connector (J8.37)
CSI3_D1_P: module (J1.E27), m2_connector (J8.39)
CVBD: carrier (R4.1), module (J1.B8)
DP0_D0_N: module (J1.H38), ethernet_hdmi (C30.2)
DP0_D0_P: module (J1.H39), ethernet_hdmi (C31.2)
DP0_D1_N: module (J1.F37), ethernet_hdmi (C28.2)
DP0_D1_P: module (J1.F38), ethernet_hdmi (C29.2)
DP0_D2_N: module (J1.G36), ethernet_hdmi (C26.2)
DP0_D2_P: module (J1.G37), ethernet_hdmi (C27.2)
DP0_D3_N: module (J1.H35), ethernet_hdmi (C24.2)
DP0_D3_P: module (J1.H36), ethernet_hdmi (C25.2)
DPM2_AUX_N: module (J1.A34), m2_connector (J8.14)
DPM2_AUX_P: module (J1.A35), m2_connector (J8.16)
DPM2_D0_N: module (J1.E35), m2_connector (J8.20)
DPM2_D0_P: module (J1.E36), m2_connector (J8.22)
DPM2_D1_N: module (J1.D36), m2_connector (J8.26)
DPM2_D1_P: module (J1.D37), m2_connector (J8.28)
DPM2_D2_N: module (J1.C37), m2_connector (J8.32)
DPM2_D2_P: module (J1.C38), m2_connector (J8.34)
DPM2_D3_N: module (J1.E38), m2_connector (J8.38)
DPM2_D3_P: module (J1.E39), m2_connector (J8.40)
EN_OTG: carrier (U1.20), psu_and_discharge (U12.5)
MCU_SCL: carrier (R9.1 U1.29), SR1 (J6_SR1.9 J7_SR1.9 U6_SR1.23), SR2 (J6_SR2.9 J7_SR2.9 U6_SR2.23), psu_and_discharge (D9.C2 R84.1 U12.13), front_io (U16.21 U17.23)
MCU_SDA: carrier (R10.1 U1.30), SR1 (J6_SR1.10 J7_SR1.10 U6_SR1.24), SR2 (J6_SR2.10 J7_SR2.10 U6_SR2.24), psu_and_discharge (D9.C1 R83.1 U12.12), front_io (U16.20 U17.24)
MDI0_N: module (J1.E49), ethernet_hdmi (J10.10)
MDI0_P: module (J1.E48), ethernet_hdmi (J10.11)
MDI1_N: module (J1.F48), ethernet_hdmi (J10.5)
MDI1_P: module (J1.F47), ethernet_hdmi (J10.4)
MDI2_N: module (J1.G49), ethernet_hdmi (J10.2)
MDI2_P: module (J1.G48), ethernet_hdmi (J10.3)
MDI3_N: module (J1.H48), ethernet_hdmi (J10.9)
MDI3_P: module (J1.H47), ethernet_hdmi (J10.8)
NetC12_2: carrier (C12.2 Q1.D S1.1), module (J1.B50)
NetC15_2: carrier (C15.2 S2.1), module (J1.A47)
NetC16_2: carrier (C16.2 S3.1), module (J1.E1)
NetC17_2: carrier (C17.2 S4.1), module (J1.E2)
NetC94_2: module (J1.B37), usb_connectors (C94.2 C95.2 FB19.2 J15.1)
NetC120_2: carrier (C120.2 J16.3 R108.1), module (J1.B17)
NetD13_5: module (J1.A36), usb_connectors (D13.5 J15.4)
NetD14_4: module (J1.F17), m2_connector (D14.4 J9.SW1)
NetJ1_A6: carrier (U2.5), module (J1.A6)
NetJ1_A7: carrier (Q2.D), module (J1.A7)
NetJ1_A17: module (J1.A17), usb_connectors (R102.1 U13.4)
NetJ1_A18: module (J1.A18), usb_connectors (R103.1 U14.4)
NetJ1_A20: module (J1.A20), m2_connector (J8.3)
NetJ1_A21: module (J1.A21), m2_connector (J8.5)
NetJ1_A33: module (J1.A33), m2_connector (J8.8)
NetJ1_B6: carrier (U2.4), module (J1.B6)
NetJ1_B7: module (J1.B7), psu_and_discharge (Q12.G R82.2)
NetJ1_B15: module (J1.B15), m2_connector (J8.4)
NetJ1_B16: module (J1.B16), m2_connector (J8.6)
NetJ1_B33: module (J1.B33), ethernet_hdmi (U9.5)
NetJ1_B34: module (J1.B34), ethernet_hdmi (R33.1 U9.3)
NetJ1_B35: module (J1.B35), ethernet_hdmi (R32.1 U9.2)
NetJ1_B36: module (J1.B36), ethernet_hdmi (Q4.D R28.1)
NetJ1_C6: module (J1.C6), front_raspicams (U4.3 U5.6)
NetJ1_C7: carrier (Q3.D), module (J1.C7)
NetJ1_C8: carrier (U7.4), module (J1.C8)
NetJ1_C16: carrier (Q26.G R31.1), module (J1.C16)
NetJ1_D5: carrier (U7.2), module (J1.D5)
NetJ1_D6: module (J1.D6), front_raspicams (U4.2 U5.5)
NetJ1_D8: carrier (U7.3), module (J1.D8)
NetJ1_D9: carrier (U2.3), module (J1.D9)
NetJ1_D10: carrier (U2.2), module (J1.D10)
NetJ1_D15: module (J1.D15), sound (U15.9)
NetJ1_D47: module (J1.D47), m2_connector (J8.10)
NetJ1_E15: module (J1.E15), sound (U15.10)
NetJ1_E47: module (J1.E47), ethernet_hdmi (R27.2)
NetJ1_F1: module (J1.F1), sound (U15.8)
NetJ1_F2: module (J1.F2), sound (U15.31)
NetJ1_F7: module (J1.F7), m2_connector (J8.9)
NetJ1_F8: module (J1.F8), m2_connector (J8.7)
NetJ1_F9: module (J1.F9), front_raspicams (U4.4)
NetJ1_F46: module (J1.F46), ethernet_hdmi (R36.1)
NetJ1_F50: module (J1.F50), ethernet_hdmi (R37.2)
NetJ1_G1: module (J1.G1), sound (U15.4)
NetJ1_G2: module (J1.G2), sound (U15.7)
NetJ1_G8: module (J1.G8), front_raspicams (U4.5)
NetJ1_H1: module (J1.H1), sound (U15.6)
NetJ1_H2: module (J1.H2), sound (U15.5)
NetJ1_H16: module (J1.H16), m2_connector (R23.1)
NetQ9_G: carrier (R4.2), psu_and_discharge (Q9.G R72.2 U10.3)
NetQ10_D: carrier (R5.2), psu_and_discharge (Q10.D Q14.G U10.2)
NetQ13_G: carrier (R8.2), psu_and_discharge (Q13.G Q15.G R81.1)
NetU1_59: carrier (U1.59), front_io (U16.10)
NetU1_61: carrier (U1.61), front_io (U16.12)
NetU1_62: carrier (U1.62), front_io (U16.13)
NVM_SCK: module (J1.C15), front_io (J18.2 J19.2)
NVM_SD: module (J1.C14), front_io (J18.4 J19.4 R112.2)
NVM_WS: module (J1.D13), front_io (J18.3 J19.3)
PROCHOT: carrier (U1.21), psu_and_discharge (U12.11)
SATA_RX_N: module (J1.G45), m2_connector (J8.55)
SATA_RX_P: module (J1.G46), m2_connector (J8.57)
SATA_TX_N: module (J1.D45), m2_connector (J8.49)
SATA_TX_P: module (J1.D46), m2_connector (J8.51)
SDC_CLK: module (J1.G18), m2_connector (D15.4 J9.5)
SDC_CMD: module (J1.G19), m2_connector (R25.1)
SDC_D0: module (J1.H18), m2_connector (R26.1)
SDC_D1: module (J1.H17), m2_connector (R125.1)
SDC_D2: module (J1.F19), m2_connector (R126.1)
SDC_D3: module (J1.F18), m2_connector (R127.1)
USB0_D_N: module (J1.B40), usb_connectors (D13.1 J15.2)
USB0_D_P: module (J1.B39), usb_connectors (D13.2 J15.3)
USB0_RX_N: module (J1.G40), usb_connectors (D11.5 J14.5)
USB0_RX_P: module (J1.G39), usb_connectors (D11.4 J14.6)
USB0_TX_N: module (J1.D40), usb_connectors (C91.2)
USB0_TX_P: module (J1.D39), usb_connectors (C90.2)
USB1_D_N: module (J1.A39), usb_connectors (D16.5 J14.2)
USB1_D_P: module (J1.A38), usb_connectors (D16.4 J14.3)
USB1_RX_N: module (J1.G43), usb_connectors (D12.4 J15.9)
USB1_RX_P: module (J1.G42), usb_connectors (D12.5 J15.10)
USB1_TX_N: module (J1.D43), usb_connectors (C97.2)
USB1_TX_P: module (J1.D42), usb_connectors (C96.2)
USBM2_D_N: module (J1.B43), m2_connector (J8.58)
USBM2_D_P: module (J1.B42), m2_connector (J8.56)
USBM2_RX_N: module (J1.F44), m2_connector (J8.44)
USBM2_RX_P: module (J1.F43), m2_connector (J8.46)
USBM2_TX_N: module (J1.C44), m2_connector (J8.50)
USBM2_TX_P: module (J1.C43), m2_connector (J8.52)